# EAGLE design ham-power (EAGLE 5.07)
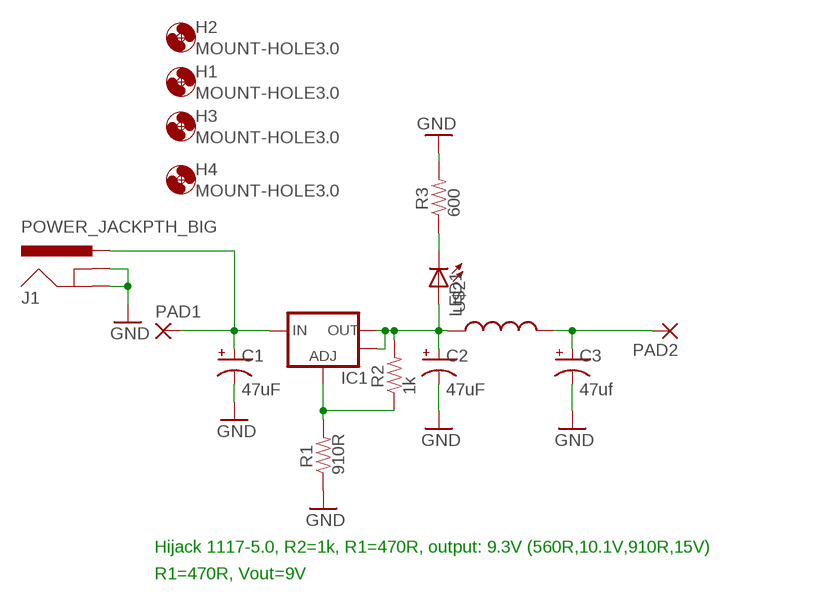
[diagram p0: schematic, sheet 1]

## Parts
C1  47uF  CAP_POL-CT6032  [CT6032]
C2  47uF  CAP_POL-CT6032  [CT6032]
C3  47uf  CAP_POL-CT6032  [CT6032]
H1  MOUNT-HOLE3.0  [3,0]
H2  MOUNT-HOLE3.0  [3,0]
H3  MOUNT-HOLE3.0  [3,0]
H4  MOUNT-HOLE3.0  [3,0]
IC1  V_REG_LM1117SOT223  [SOT223]
J1  POWER_JACKPTH_BIG  [POWER_JACK_2.1X5.5_BIG_PTH]
LED1  LED1206  [LED-1206]
PAD1  SMD5  [SMD2,54-5,08]
PAD2  SMD5  [SMD2,54-5,08]
R1  910R  RESISTOR-R0805W  [R0805W]
R2  1k  RESISTOR-R0805W  [R0805W]
R3  600  RESISTOR1/4W-RF  [AXIAL-0.3-SMD]
U$2  INDUCTOR-0.3-SMD  [AXIAL-0.3-SMD]

## Nets
GND: C1.- C2.- C3.- J1.GND J1.GNDBREAK R1.1 R3.P$2
N$1: IC1.1(ADJ) R1.2 R2.1
N$2: C1.+ IC1.3(IN) J1.PWR PAD1.1(P)
N$3: C2.+ IC1.2(OUT) IC1.4(OUT) LED1.A R2.2 U$2.P$1
N$4: LED1.C R3.P$1
N$5: C3.+ PAD2.1(P) U$2.P$2

## Notes on the sheet
- Hijack 1117-5.0, R2=1k, R1=470R, output: 9.3V (560R,10.1V,910R,15V)
- R1=470R, Vout=9V

## Library data of the parts
C1-C3 = digital-toy:CAP_POL: Capacitor Polarized These are standard SMD and PTH capacitors. Normally 10uF, 47uF, and 100uF in electrolytic and tantalum varieties. Always verify the external diameter of the through hole cap, it varies with capacity, voltage, and manufacturer. The EIA devices should be standard. PANASONIC_D size: 6.5mmx6.5mmx5.5mm, 100uf (taobao:6.3mmx5.5mm), same as CVL0605 153cvl0405 size: 4mmx4mmx5.5mm, 10uf (taobao:4mmx5.5mm) ct6032 typical 47uF Tantalum, comment by hyl.
H1-H4 = holes:MOUNT-HOLE: MOUNTING HOLE with drill center marker
IC1 = digital-toy:V_REG_LM1117: Voltage Regulator LM1117 Standard adjustable voltage regulator but in SMD form. Spark Fun Electronics SKU : COM-00595
J1 = digital-toy:POWER_JACK: Power Jack This is the standard 5.5mm barrel jack for power. The PTH is the most common, proven, reliable, footprint. All others are experimental. The Slot footprint only works if the mill layer is transmitted to the PCB fab house so be warned. Spark Fun Electronics SKU : PRT-00119. Mating wall wart : TOL-00298 (and others)
LED1 = digital-toy:LED: LEDs Standard schematic elements and footprints for 5mm, 3mm, 1206, and 0603 sized LEDs. 5mm - Spark Fun Electronics SKU : COM-00529 (and others) copy led.lbr 0805 led here, by hyl digital-toy. 2010.6.29
PAD1 PAD2 = wirepad:SMD5: SMD PAD
R1-R3 = digital-toy:RESISTOR: Resistor Basic schematic elements and footprints for 0603, 1206, and PTH 1/10th watt (small) resistors. digital-toy copy vertical mount of axial-0.3 from rcl.lbr : the 0207/xx 3W resistor: 0617/17, 0617/22, 0617V
U$2 = digital-toy:INDUCTOR: Inductors Basic Inductor/Choke - 0603 and 1206. Footprints are not proven and vary greatly between part numbers.

## Board
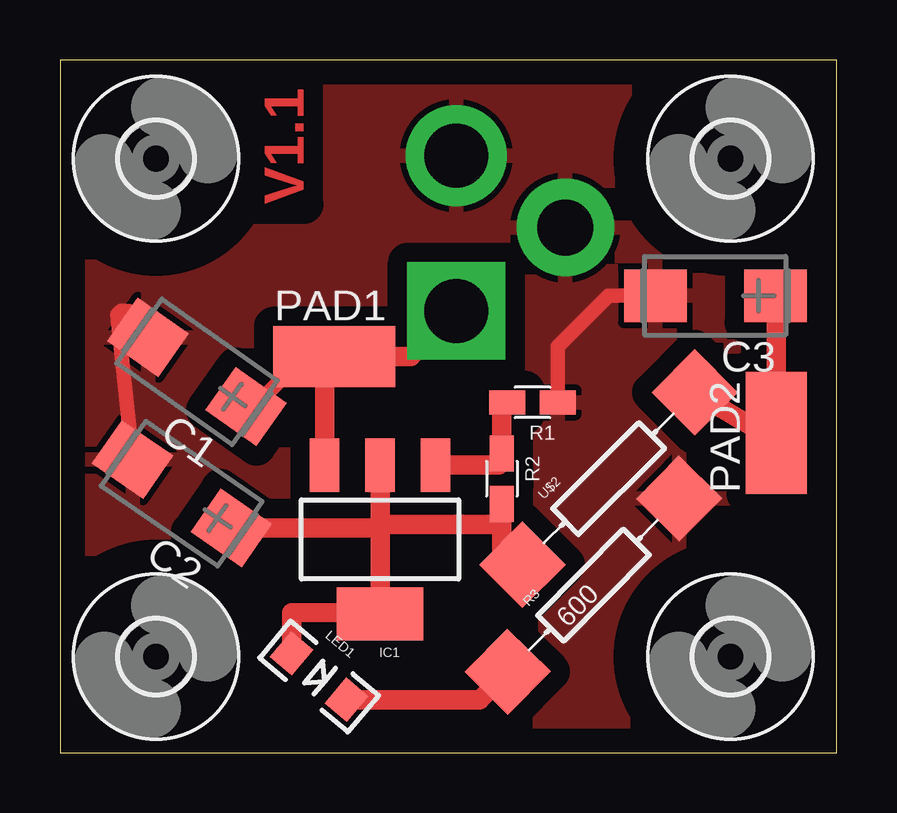
[diagram p1: board, top side]
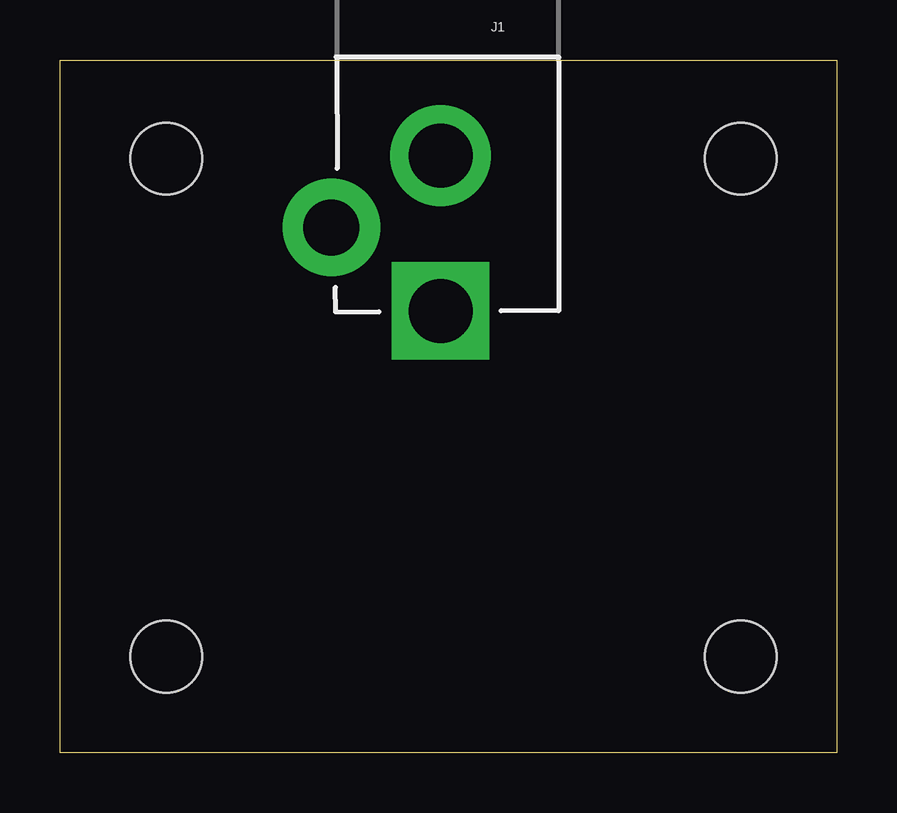
[diagram p2: board, bottom side, seen from below]

Size 32.37 x 28.88 mm. Coordinates in mm from the lower left corner, seen from the top.
Outline: 0,0 32.37,0 32.37,28.88 0,28.88 0,0
Copper layers (1*16): Top 0.035mm / dielectric 1.5mm / Bottom 0.035mm
Design rules "default": minimum track width 10mil, minimum drill 24mil, track to track 8mil, track to pad 8mil, pad to pad 8mil, via to via 8mil, smd to smd 8mil, copper to edge 40mil, drill to drill 8mil, minimum pad ring 10mil, minimum via ring 8mil, stop-mask expansion 4mil, vias tented up to drill 0mil, thermal gap 10mil

### Footprints (pad centres in the part's own frame; a part is rotated, then mirrored left to right if it is on the bottom)
CT6032 = smd 2.6 x 2.2: + -2.5,0; - 2.5,0
3,0 = hole 3: 0,0
SOT223 = smd 1.219 x 2.235: 1 -2.311,-3.099; 2 0,-3.099; 3 2.311,-3.099 | smd 3.6 x 2.2: 4 0,3.099
POWER_JACK_2.1X5.5_BIG_PTH = drill 2.667 pad 4.191 round: GND 0,-0.127 | drill 2.337 pad 4.064 round: GNDBREAK 4.547,2.87 | drill 2.667 pad 4.064 square: PWR 0,6.35
LED-1206 = smd 1.2 x 1.4: A -1.5,0; C 1.5,0
SMD2,54-5,08 = smd 2.54 x 5.08: 1 0,0
R0805W = smd 1.5 x 1: 1 -1.052,0; 2 1.052,0
AXIAL-0.3-SMD = smd 2.54 x 2.54: P$1 -5.08,0; P$2 5.08,0

### Placement (x,y rotation side)
C1  5.71,15.88 144.8 top
C2  5.08,10.79 145.4 top
C3  27.3,19.05 180 top
H1  4,4 0 top
H2  27.94,24.77 0 top
H3  27.94,4 0 top
H4  4,24.77 0 top
IC1  13.34,8.89 180 top
J1  16.51,24.77 180 bottom
LED1  10.79,3.17 319.9 top
PAD1  11.43,16.51 270 top
PAD2  29.84,13.34 0 top
R1  19.68,14.61 180 top
R2  18.41,11.43 270 top
R3  22.23,6.99 45.3 top
U$2  22.86,11.43 45 top

### Tracks (layer width: path | path; a pad name or v marks a point on that pad's centre or on a via)
GND
  Top 0.61: R1.1 20.74,16.93 22.86,19.05 C3.- | C2.- 2.39,18.26 2.54,18.41 2.87,18.41 C1.-
  pour Top (isolate 0.813): -1.27,31.11 31.75,31.11 36.2,26.67 36.2,0.64 31.11,-4.45 -1.91,-4.45 -5.71,-0.64 -5.71,27.3 -1.27,31.75
N$1
  Top 0.61: 18.27,11.99 R2.1 | 18.41,14.39 R1.2
  Top 0.813: IC1.1 18.27,11.99 | R2.1 18.41,14.39
N$2
  Top 0.61: C1.+ 8.08,14.43 10.16,16.51 PAD1.1 11.02,16.1
  Top 0.813: PAD1.1 14.61,16.51 J1.PWR | IC1.3 11.02,16.1
N$3
  Top 0.61: IC1.4 13.34,6.35 12.83,5.84 | 18.41,8.26 U$2.P$1
  Top 0.813: 13.34,6.35 13.34,9.53 | 13.34,9.53 IC1.2 | 18.41,9.53 18.41,8.26 | 18.41,9.53 R2.2 | C2.+ 13.19,9.38 13.34,9.53 | LED1.A 9.65,5.84 12.83,5.84 | 13.34,9.53 18.41,9.53
N$4
  Top 0.813: LED1.C 17.49,2.21 R3.P$1
N$5
  Top 0.61: 29.63,13.12 PAD2.1 | 29.84,19.01 C3.+
  Top 0.813: U$2.P$2 29.63,13.12 | PAD2.1 29.84,19.01

### Text on the board
Top: V1.1